# Altium schematic sheet saunamadis.SchDoc
size A3; SheetNumber: 1; SheetTotal: 1
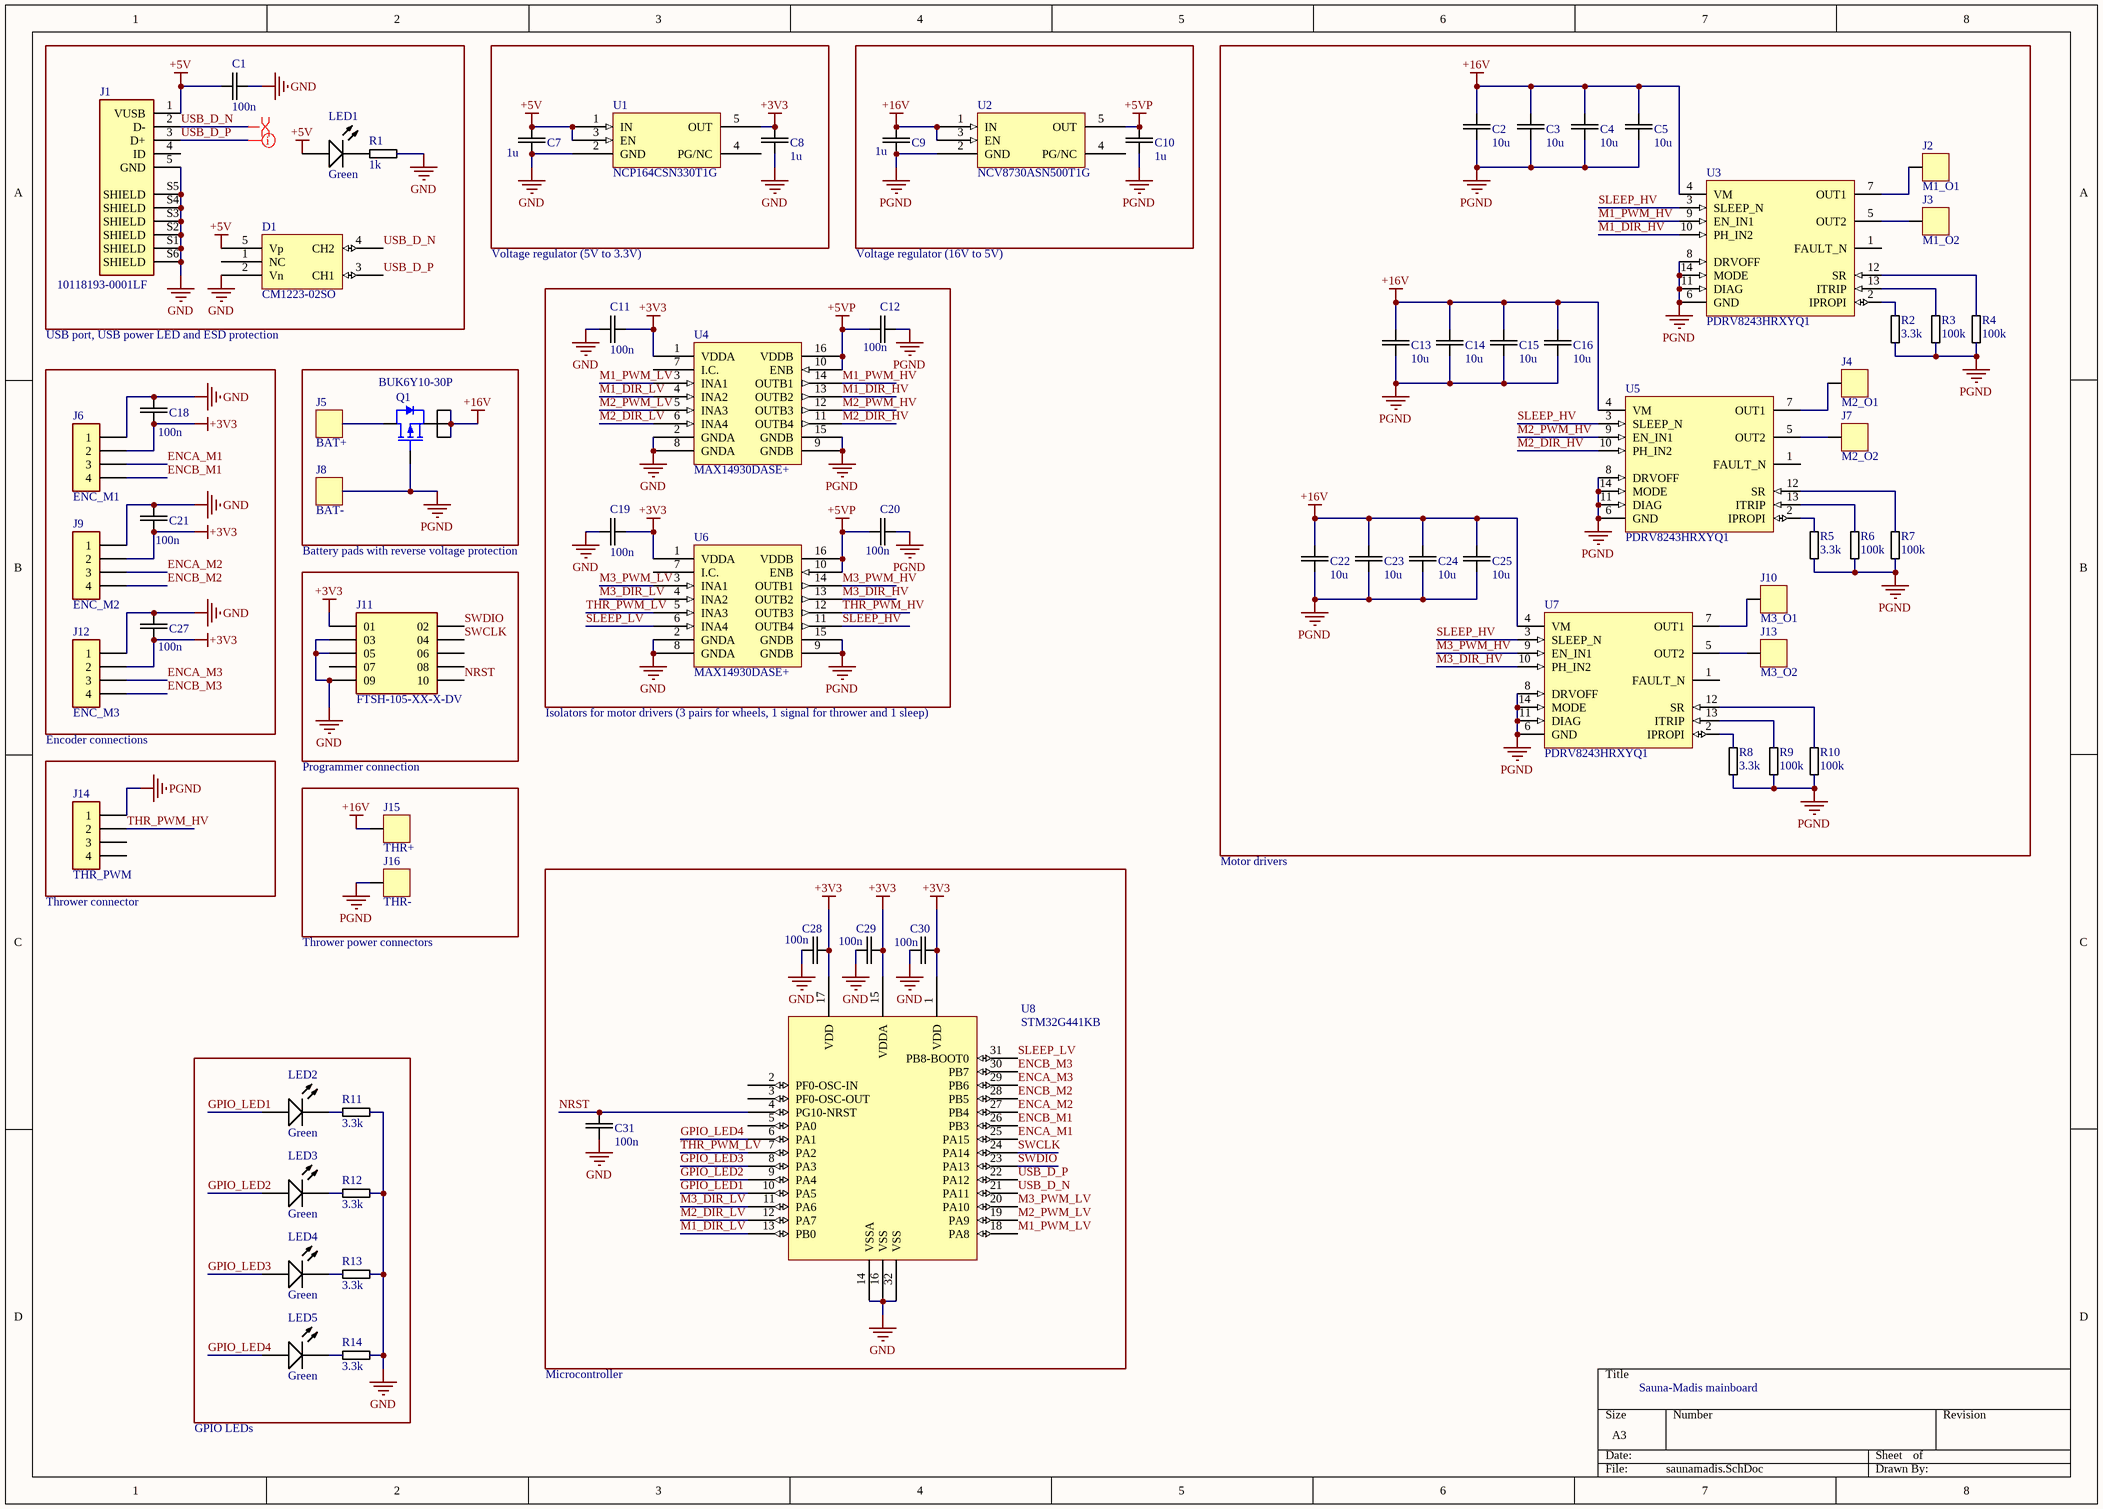
[diagram p0: saunamadis.SchDoc]

## Parts
C1  c: 100n  [0603R]  (hidden comment: 0603C)
C2  c: 10u  [1206 cap]  (hidden comment: 0603C)
C3  c: 10u  [1206 cap]  (hidden comment: 0603C)
C4  c: 10u  [1206 cap]  (hidden comment: 0603C)
C5  c: 10u  [1206 cap]  (hidden comment: 0603C)
C7  c: 1u  [0603R]  (hidden comment: 0603C)
C8  c: 1u  [0603R]  (hidden comment: 0603C)
C9  c: 1u  [0603R]  (hidden comment: 0603C)
C10  c: 1u  [0603R]  (hidden comment: 0603C)
C11  c: 100n  [0603R]  (hidden comment: 0603C)
C12  c: 100n  [0603R]  (hidden comment: 0603C)
C13  c: 10u  [1206 cap]  (hidden comment: 0603C)
C14  c: 10u  [1206 cap]  (hidden comment: 0603C)
C15  c: 10u  [1206 cap]  (hidden comment: 0603C)
C16  c: 10u  [1206 cap]  (hidden comment: 0603C)
C18  c: 100n  [0603R]  (hidden comment: 0603C)
C19  c: 100n  [0603R]  (hidden comment: 0603C)
C20  c: 100n  [0603R]  (hidden comment: 0603C)
C21  c: 100n  [0603R]  (hidden comment: 0603C)
C22  c: 10u  [1206 cap]  (hidden comment: 0603C)
C23  c: 10u  [1206 cap]  (hidden comment: 0603C)
C24  c: 10u  [1206 cap]  (hidden comment: 0603C)
C25  c: 10u  [1206 cap]  (hidden comment: 0603C)
C27  c: 100n  [0603R]  (hidden comment: 0603C)
C28  c: 100n  [0603R]  (hidden comment: 0603C)
C29  c: 100n  [0603R]  (hidden comment: 0603C)
C30  c: 100n  [0603R]  (hidden comment: 0603C)
C31  c: 100n  [0603R]  (hidden comment: 0603C)
D1  CM1223-02SO  [CM1223-02SO]
J1  10118193-0001LF  [FCI_10118193-0001LF]
J2  Name: M1_O1  [Pad]  (hidden comment: Pad)
J3  Name: M1_O2  [Pad]  (hidden comment: Pad)
J4  Name: M2_O1  [Pad]  (hidden comment: Pad)
J5  Name: BAT+  [Pad]  (hidden comment: Pad)
J6  ENC_M1  [TE_7-215079-4]
J7  Name: M2_O2  [Pad]  (hidden comment: Pad)
J8  Name: BAT-  [Pad]  (hidden comment: Pad)
J9  ENC_M2  [TE_7-215079-4]
J10  Name: M3_O1  [Pad]  (hidden comment: Pad)
J11  FTSH-105-XX-X-DV  [SAMTEC_FTSH-105-XX-X-DV]
J12  ENC_M3  [TE_7-215079-4]
J13  Name: M3_O2  [Pad]  (hidden comment: Pad)
J14  THR_PWM  [TE_7-215079-4]
J15  Name: THR+  [Pad]  (hidden comment: Pad)
J16  Name: THR-  [Pad]  (hidden comment: Pad)
LED1  color: Green  [LEDwhite0603]  (hidden comment: LED)
LED2  color: Green  [LEDwhite0603]  (hidden comment: LED)
LED3  color: Green  [LEDwhite0603]  (hidden comment: LED)
LED4  color: Green  [LEDwhite0603]  (hidden comment: LED)
LED5  color: Green  [LEDwhite0603]  (hidden comment: LED)
Q1  BUK6Y10-30P  [BUK6Y10-30P]
R1  RESISTANCE: 1k  [0603R]  (hidden comment: 0603R)
R2  RESISTANCE: 3.3k  [0603R]  (hidden comment: 0603R)
R3  RESISTANCE: 100k  [0603R]  (hidden comment: 0603R)
R4  RESISTANCE: 100k  [0603R]  (hidden comment: 0603R)
R5  RESISTANCE: 3.3k  [0603R]  (hidden comment: 0603R)
R6  RESISTANCE: 100k  [0603R]  (hidden comment: 0603R)
R7  RESISTANCE: 100k  [0603R]  (hidden comment: 0603R)
R8  RESISTANCE: 3.3k  [0603R]  (hidden comment: 0603R)
R9  RESISTANCE: 100k  [0603R]  (hidden comment: 0603R)
R10  RESISTANCE: 100k  [0603R]  (hidden comment: 0603R)
R11  RESISTANCE: 3.3k  [0603R]  (hidden comment: 0603R)
R12  RESISTANCE: 3.3k  [0603R]  (hidden comment: 0603R)
R13  RESISTANCE: 3.3k  [0603R]  (hidden comment: 0603R)
R14  RESISTANCE: 3.3k  [0603R]  (hidden comment: 0603R)
U1  NCP164CSN330T1G  [NCP164CSN330T1G/NCV8730ASN500T1G]
U2  NCV8730ASN500T1G  [NCP164CSN330T1G/NCV8730ASN500T1G]
U3  PDRV8243HRXYQ1  [PDRV8243HRXYQ1]
U4  MAX14930DASE+  [MAX14930DASE+]
U5  PDRV8243HRXYQ1  [PDRV8243HRXYQ1]
U6  MAX14930DASE+  [MAX14930DASE+]
U7  PDRV8243HRXYQ1  [PDRV8243HRXYQ1]
U8  STM32G441KB  [TQFP80P900X900X160-32N]

## Blocks framed on the sheet
Battery pads with reverse voltage protection: J11
Encoder connections: J14
Programmer connection: J15 J16

## Nets
+3V3: C8.2 C11.1 C18.1 C19.1 C21.1 C27.1 C28.1 C29.1 C30.1 J6.2 J9.2 J11.01 J12.2 U1.5(OUT) U4.1(VDDA) U6.1(VDDA) U8.1(VDD) U8.15(VDDA) U8.17(VDD)
+5V: C1.1 C7.2 D1.5(Vp) J1.1(VUSB) LED1.1(A) U1.1(IN) U1.3(EN)
+5VP: C10.2 C12.2 C20.2 U2.5(OUT) U4.10(ENB) U4.16(VDDB) U6.10(ENB) U6.16(VDDB)
+16V: C2.1 C3.1 C4.1 C5.1 C9.2 C13.1 C14.1 C15.1 C16.1 C22.1 C23.1 C24.1 C25.1 J15.1 Q1.1(SOURCE) Q1.2(SOURCE) Q1.3(SOURCE) U2.1(IN) U2.3(EN) U3.4(VM) U5.4(VM) U7.4(VM)
GND: C1.2 C7.1 C8.1 C11.2 C18.2 C19.2 C21.2 C27.2 C28.2 C29.2 C30.2 C31.2 D1.2(Vn) J1.5(GND) J1.S1(SHIELD) J1.S2(SHIELD) J1.S3(SHIELD) J1.S4(SHIELD) J1.S5(SHIELD) J1.S6(SHIELD) J6.1 J9.1 J11.03 J11.05 J11.09 J12.1 R1.2 R11.1 R12.1 R13.1 R14.1 U1.2(GND) U4.2(GNDA) U4.8(GNDA) U6.2(GNDA) U6.8(GNDA)
PGND: C2.2 C3.2 C4.2 C5.2 C9.1 C10.1 C12.1 C13.2 C14.2 C15.2 C16.2 C20.1 C22.2 C23.2 C24.2 C25.2 J8.1 J14.1 J16.1 Q1.4(GATE) R2.1 R3.2 R4.2 R5.1 R6.2 R7.2 R8.1 R9.2 R10.2 U2.2(GND) U3.6(GND) U3.8(DRVOFF) U3.11(DIAG) U3.14(MODE) U4.9(GNDB) U4.15(GNDB) U5.6(GND) U5.8(DRVOFF) U5.11(DIAG) U5.14(MODE) U6.9(GNDB) U6.15(GNDB) U7.6(GND) U7.8(DRVOFF) U7.11(DIAG) U7.14(MODE)
ENCA_M1: J6.3 U8.25(PA15)
ENCA_M2: J9.3 U8.27(PB4)
ENCA_M3: J12.3 U8.29(PB6)
ENCB_M1: J6.4 U8.26(PB3)
ENCB_M2: J9.4 U8.28(PB5)
ENCB_M3: J12.4 U8.30(PB7)
GPIO_LED1: LED2.1(A) U8.10(PA5)
GPIO_LED2: LED3.1(A) U8.9(PA4)
GPIO_LED3: LED4.1(A) U8.8(PA3)
GPIO_LED4: LED5.1(A) U8.6(PA1)
M1_DIR_HV: U3.10(PH_IN2) U4.13(OUTB2)
M1_DIR_LV: U4.4(INA2) U8.13(PB0)
M1_PWM_HV: U3.9(EN_IN1) U4.14(OUTB1)
M1_PWM_LV: U4.3(INA1) U8.18(PA8)
M2_DIR_HV: U4.11(OUTB4) U5.10(PH_IN2)
M2_DIR_LV: U4.6(INA4) U8.12(PA7)
M2_PWM_HV: U4.12(OUTB3) U5.9(EN_IN1)
M2_PWM_LV: U4.5(INA3) U8.19(PA9)
M3_DIR_HV: U6.13(OUTB2) U7.10(PH_IN2)
M3_DIR_LV: U6.4(INA2) U8.11(PA6)
M3_PWM_HV: U6.14(OUTB1) U7.9(EN_IN1)
M3_PWM_LV: U6.3(INA1) U8.20(PA10)
NRST: C31.1 J11.10 U8.4(PG10-NRST)
SLEEP_HV: U3.3(SLEEP_N) U5.3(SLEEP_N) U6.11(OUTB4) U7.3(SLEEP_N)
SLEEP_LV: U6.6(INA4) U8.31(PB8-BOOT0)
SWCLK: J11.04 U8.24(PA14)
SWDIO: J11.02 U8.23(PA13)
THR_PWM_HV: J14.2 U6.12(OUTB3)
THR_PWM_LV: U6.5(INA3) U8.7(PA2)
USB_D_N: D1.4(CH2) J1.2(D-) U8.21(PA11)
USB_D_P: D1.3(CH1) J1.3(D+) U8.22(PA12)
NetJ2_1: J2.1 U3.7(OUT1)
NetJ3_1: J3.1 U3.5(OUT2)
NetJ4_1: J4.1 U5.7(OUT1)
NetJ5_1: J5.1 Q1.5(DRAIN)
NetJ7_1: J7.1 U5.5(OUT2)
NetJ10_1: J10.1 U7.7(OUT1)
NetJ13_1: J13.1 U7.5(OUT2)
NetLED1_2: LED1.2(K) R1.1
NetLED2_2: LED2.2(K) R11.2
NetLED3_2: LED3.2(K) R12.2
NetLED4_2: LED4.2(K) R13.2
NetLED5_2: LED5.2(K) R14.2
NetR2_2: R2.2 U3.2(IPROPI)
NetR3_1: R3.1 U3.13(ITRIP)
NetR4_1: R4.1 U3.12(SR)
NetR5_2: R5.2 U5.2(IPROPI)
NetR6_1: R6.1 U5.13(ITRIP)
NetR7_1: R7.1 U5.12(SR)
NetR8_2: R8.2 U7.2(IPROPI)
NetR9_1: R9.1 U7.13(ITRIP)
NetR10_1: R10.1 U7.12(SR)

Not connected (* = marked no-connect by the designer): D1 1(NC); J1 4(ID); J11 06 07 08; J14 3 4; U1 4(PG/NC); U2 4(PG/NC); U3 1(FAULT_N); U4 7(I.C.); U5 1(FAULT_N); U6 7(I.C.); U7 1(FAULT_N); U8 2(PF0-OSC-IN) 3(PF0-OSC-OUT) 5(PA0) 14(VSSA) 16(VSS) 32(VSS)

## Layout directives
differential pair: USB_D_N, USB_D_P

## Notes on the sheet
- Voltage regulator (5V to 3.3V)
- Voltage regulator (16V to 5V)
- USB port, USB power LED and ESD protection
- Isolators for motor drivers (3 pairs for wheels, 1 signal for thrower and 1 sleep)
- (near J14) Thrower connector
- Motor drivers
- Thrower power connectors
- Microcontroller
- Sauna-Madis mainboard
- GPIO LEDs

## Library data of the parts
C1-C5 C7-C16 C18-C25 C27-C31 = 0603C: Capacitor
D1 = CM1223-02SO: TVS diode
J1 = 10118193-0001LF: USB - micro B USB 2.0 Receptacle Connector 5 Position Surface Mount, Right Angle; Through Hole; MF: Amphenol ICC; Availability: Unavailable; SnapEDA_Link: https://www.snapeda.com/parts/10118193-0001LF/Amphenol%20FCI/view-part/2758989/?ref=snap; MP: 10118193-0001LF; Price: None; Value: *; Package: None
J6 J9 J12 J14 = 7-215079-4: Micro-MaTch 4 Position 1.27 mm Pitch Vertical Female-on-Board Connector; MF: TE Connectivity; MP: 7-215079-4; Value: *; SnapEDA_Link: https://www.snapeda.com/parts/7-215079-4/TE%20Connectivity%20AMP%20Connectors/view-part/453401/?ref=snap; Price: None; Package: SMD-6; Availability: Unavailable
J11 = FTSH-105-XX-X-DV: Connector Header Surface Mount 10 position 0.050" (1.27mm); Availability: Unavailable; Package: None; MP: FTSH-105-XX-X-DV; Price: None; Value: *
Q1 = BUK6Y10-30P: Reverse voltage protection
R1-R14 = 0603R: resistor
U1 = NCP164CSN330T1G: Voltage regulator for microcontroller
U2 = NCV8730ASN500T1G: Voltage regulator at the motor driver’s side
U3 U5 U7 = PDRV8243HRXYQ1: Motor driver
U4 U6 = MAX14930DASE+: isolator
U8 = STM32G441KB: microcontroller